# Altium schematic sheet motordriver-v3.1_A3931.SchDoc
size A3
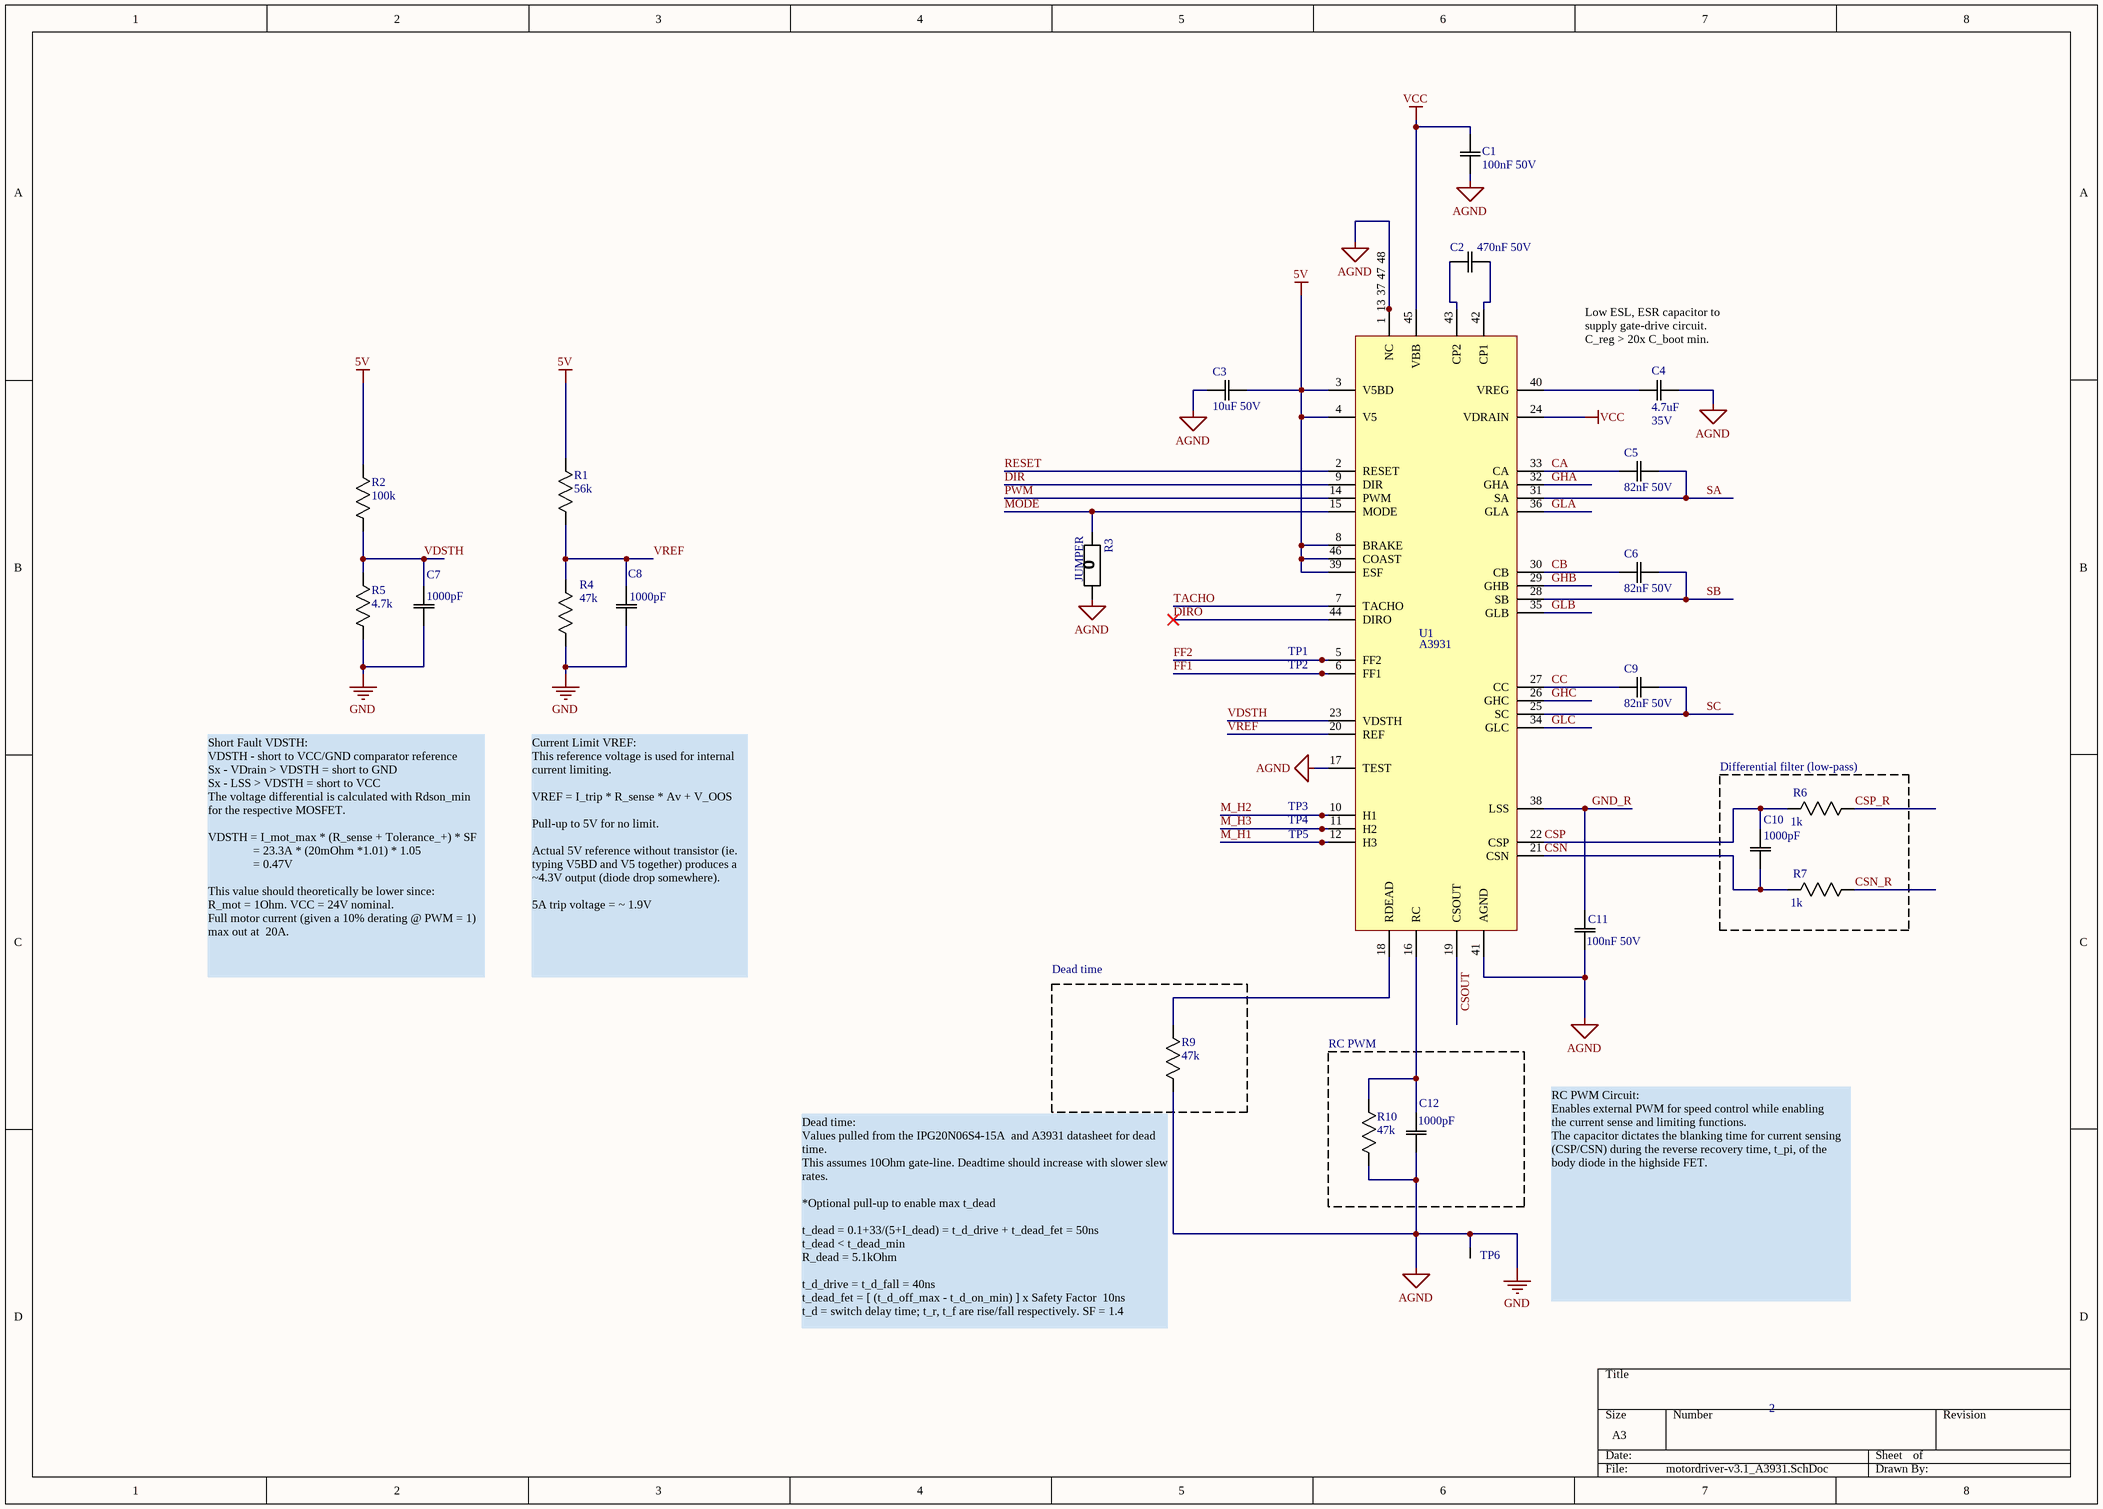
[diagram p0: motordriver-v3.1_A3931.SchDoc]

## Parts
C1  100nF 50V  [0603]
C2  470nF 50V  [0603]
C3  10uF 50V  [0805]
C4  Rating: 35V  [0603]  (hidden comment: 4.7uF)
C5  82nF 50V  [0603]
C6  82nF 50V  [0603]
C7  1000pF  [0603]
C8  1000pF  [0603]
C9  82nF 50V  [0603]
C10  1000pF  [0603]
C11  100nF 50V  [0603]
C12  1000pF  [0603]
R1  56k  [0603]
R2  100k  [0603]
R3  JUMPER  [0603]
R4  47k  [0603]
R5  4.7k  [0603]
R6  1k  [0603]
R7  1k  [0603]
R9  47k  [0603]
R10  47k  [0603]
TP1  Test Point (Via)  [TP]  (value not drawn)
TP2  Test Point (Via)  [TP]  (value not drawn)
TP3  Test Point (Via)  [TP]  (value not drawn)
TP4  Test Point (Via)  [TP]  (value not drawn)
TP5  Test Point (Via)  [TP]  (value not drawn)
TP6  Test Point (Via)  [TP]  (value not drawn)
U1  A3931  [48-LQFP-EP (7x7)]

## Blocks framed on the sheet
Differential filter (low-pass): C10 R6 R7
Dead time: R9
RC PWM: C12 R10

## Nets
5V: C3.2(C2) R1.1(R1) R2.1(R1) U1.3(V5BD) U1.4(V5) U1.8(BRAKE) U1.39(ESF) U1.46(COAST)
AGND: C1.1(C1) C3.1(C1) C4.2(C2) C7.1(C1) C8.1(C1) C11.1(C1) C12.1(C1) R3.1(R1) R4.1(R1) R5.2(R2) R9.2(R2) R10.2(R2) TP6.1 U1.1(NC) U1.13 U1.17(TEST) U1.37(NC) U1.41(AGND) U1.47(NC) U1.48(NC)  [also labelled GND]
VCC: C1.2(C2) U1.24(VDRAIN) U1.45(VBB)
CA: C5.1(C1) U1.33(CA)
CB: C6.1(C1) U1.30(CB)
CC: C9.1(C1) U1.27(CC)
CSN: C10.1(C1) R7.2(R2) U1.21(CSN)
CSN_R: R7.1(R1)
CSOUT: U1.19(CSOUT)
CSP: C10.2(C2) R6.2(R2) U1.22(CSP)
CSP_R: R6.1(R1)
DIR: U1.9(DIR)
DIRO: U1.44(DIRO)
FF1: TP2.1 U1.6(FF1)
FF2: TP1.1 U1.5(FF2)
GHA: U1.32(GHA)
GHB: U1.29(GHB)
GHC: U1.26(GHC)
GLA: U1.36(GLA)
GLB: U1.35(GLB)
GLC: U1.34(GLC)
GND_R: C11.2(C2) U1.38(LSS)
M_H1: TP5.1 U1.12(H3)
M_H2: TP3.1 U1.10(H1)
M_H3: TP4.1 U1.11(H2)
MODE: R3.2(R2) U1.15(MODE)
PWM: U1.14(PWM)
RESET: U1.2(RESET)
SA: C5.2(C2) U1.31(SA)
SB: C6.2(C2) U1.28(SB)
SC: C9.2(C2) U1.25(SC)
TACHO: U1.7(TACHO)
VDSTH: C7.2(C2) R2.2(R2) R5.1(R1) U1.23(VDSTH)
VREF: C8.2(C2) R1.2(R2) R4.2(R2) U1.20(REF)
NetC2_1: C2.1(C1) U1.43(CP2)
NetC2_2: C2.2(C2) U1.42(CP1)
NetC4_1: C4.1(C1) U1.40(VREG)
NetC12_2: C12.2(C2) R10.1(R1) U1.16(RC)
NetR9_1: R9.1(R1) U1.18(RDEAD)

## Notes on the sheet
- (near C4) Low ESL, ESR capacitor to supply gate-drive circuit.
  C_reg > 20x C_boot min.
- Short Fault VDSTH:
  VDSTH - short to VCC/GND comparator reference
  Sx - VDrain > VDSTH = short to GND
  Sx - LSS > VDSTH = short to VCC
  The voltage differential is calculated with Rdson_min for the respective MOSFET.
  VDSTH = I_mot_max * (R_sense + Tolerance_+) * SF
  = 23.3A * (20mOhm *1.01) * 1.05
  = 0.47V
  This value should theoretically be lower since:
  R_mot = 1Ohm. VCC = 24V nominal.
  Full motor current (given a 10% derating @ PWM = 1) max out at  20A.
- Current Limit VREF:
  This reference voltage is used for internal current limiting.
  VREF = I_trip * R_sense * Av + V_OOS
  Pull-up to 5V for no limit.
  Actual 5V reference without transistor (ie. typing V5BD and V5 together) produces a ~4.3V output (diode drop somewhere).
  5A trip voltage = ~ 1.9V
- (near R9) Dead time:
  Values pulled from the IPG20N06S4-15A  and A3931 datasheet for dead time.
  This assumes 10Ohm gate-line. Deadtime should increase with slower slew rates.
  *Optional pull-up to enable max t_dead
  t_dead = 0.1+33/(5+I_dead) = t_d_drive + t_dead_fet = 50ns
  t_dead < t_dead_min
  R_dead = 5.1kOhm
  t_d_drive = t_d_fall = 40ns
  t_dead_fet = [ (t_d_off_max - t_d_on_min) ] x Safety Factor  10ns
  t_d = switch delay time; t_r, t_f are rise/fall respectively. SF = 1.4
- RC PWM Circuit:
  Enables external PWM for speed control while enabling
  the current sense and limiting functions.
  The capacitor dictates the blanking time for current sensing
  (CSP/CSN) during the reverse recovery time, t_pi, of the
  body diode in the highside FET.
- 2

## Library data of the parts
C1 C11 = CAP 100nF 50V: CAP CER 0.1UF 50V X7R 0805; Tolerance: 10%; Package: 0805; Value: 100nF; Rating: 50V
C2 = CAP 470nF 50V: CAP CER 0.1UF 50V X7R 0805; Tolerance: 10%; Package: 0805; Value: 470nF; Rating: 50V
C3 = CAP 10uF 50V: CAP CER 10UF 50V X7R; Tolerance: 10%; Package: 1210; Value: 10uF; Rating: 50V; ComponentLink1Description: digikey; ComponentLink1URL: https://www.digikey.ca/en/products/detail/kemet/C1210C106M5RACTU/4918883
C4 = CAP 4.7uF 35V: CAP CER 4.7UF 35V X7R 0603/0805; Tolerance: 10%; Package: 0603/0805; Temperature Coefficient: X7R; Operating Temperature: -55°C ~ 125°C; Value: 4.7uF
C5 C6 C9 = CAP 82nF 50V: CAP CER 0.082UF 50V X7R 0805; Tolerance: 5%; Package: 0805; Value: 82nF; Rating: 50V; Alt. Value: 82nF
C7 C8 C10 C12 = CAP 1000pF 50V: CAP CER 1000PF 50V X7R 0603/0805; Tolerance: 10%; Package: 0603/0805; Value: 1000pF; Rating: 50V; Temperature Coefficient: X7R; Operating Temperature: -55°C ~ 125°C
R1 R2 = RES 100k 1/8W - 1%: RES SMD 100K OHM 1% 1/8W 0805; Power (Watts): 0.125W; Package: 0805; Value: 100k; Tolerance: 1%
R3 = RES 0 JUMPER: RES SMD 0 OHM JUMPER GENERIC 0805; Value: 0; Package: 0805
R4 R10 = RES 47k 1/8W - 1%: RES SMD 47K OHM 1% 1/8W 0805; Power (Watts): 0.125W; Package: 0805; Value: 47k; Tolerance: 1%
R5 = RES 4.7k 1/8W - 1%: RES SMD 4.7k OHM 1% 1/8W 0805; Power (Watts): 0.125W; Package: 0805; Value: 4.7k; Tolerance: 1%
R6 R7 = RES 1k 1/8W: RES SMD 1K OHM 5% 1/8W 0805; Power (Watts): 0.125W; Package: 0805; Value: 1k; Tolerance: 5%
R9 = RES 5.1k 1/8W - 1%: RES SMD 5.1K OHM 1% 1/8W 0805; Power (Watts): 0.125W; Package: 0805; Value: 5.1k; Tolerance: 1%
U1 = A3931_A1: IC MOTOR DRIVER 5.5V-50V 48LQFP - Alternative Symbol; Digikey: 620-1290-1-ND; Digikey Link: https://www.digikey.ca/product-detail/en/allegro-microsystems/A3931KJPTR-T/620-1290-1-ND/2000021; Supplier 1: Digi-Key; Supplier Part Number 1: 620-1290-1-ND